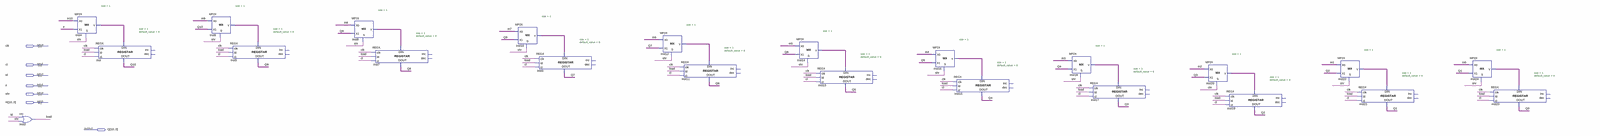
[diagram p0: schematic sheet, whole]
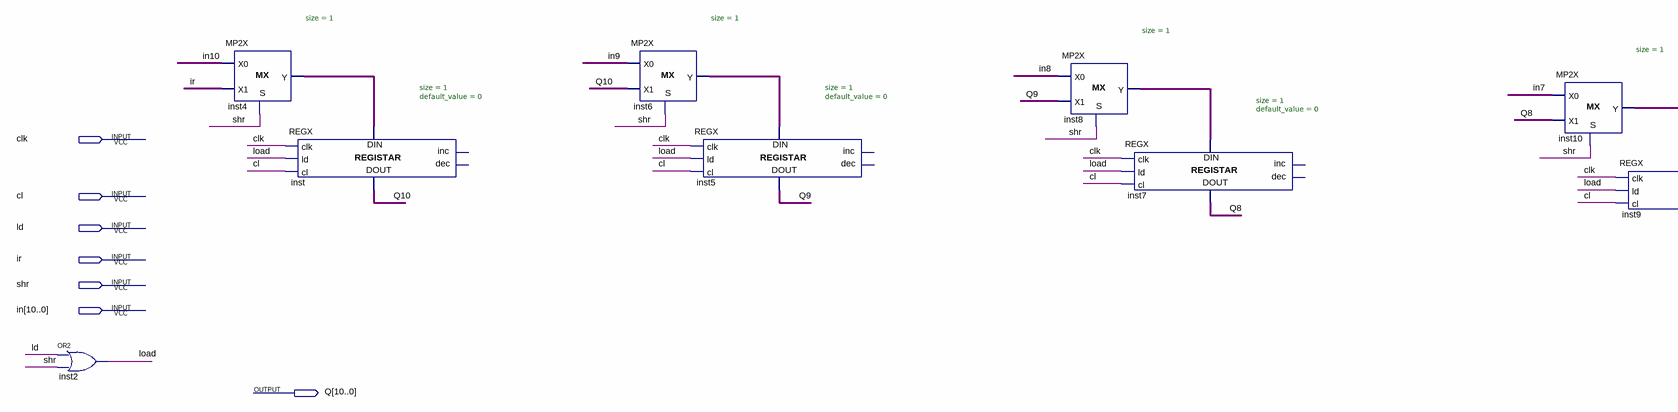
[diagram p1: schematic sheet, left part]
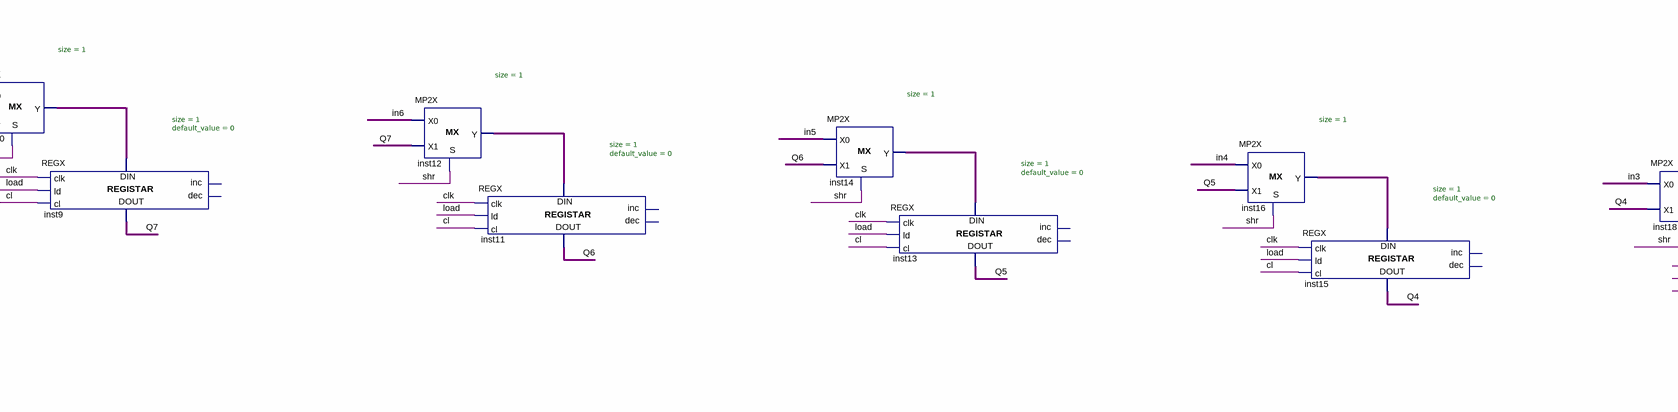
[diagram p2: schematic sheet, centre part]
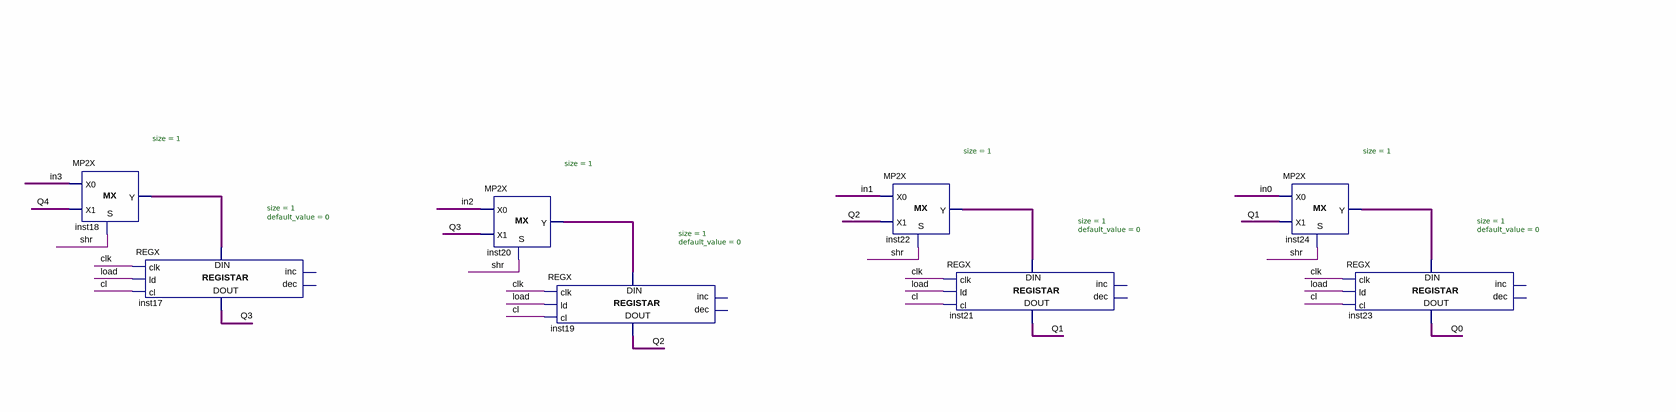
[diagram p3: schematic sheet, right part]
// Quartus schematic REG11.bdf as structural Verilog: 23 symbols, 7 pins
module REG11 (
  input  clk,
  input  cl,
  input  ld,
  input  ir,
  input  shr,
  input  [10:0] in,
  output [10:0] Q
);

  wire inst4_y, inst6_y, inst8_y, inst10_y, inst12_y, inst14_y, inst16_y, inst18_y, inst20_y, inst22_y,
       inst24_y, load;

  or inst2 (load, ld, shr);
  MP2X #(.size(1)) inst4 (.S(shr), .X0(in[10]), .X1(ir), .Y(inst4_y));
  REGX #(.size(1), .default_value(0)) inst (
    .clk(clk), .ld(load), .cl(cl), .data_in(inst4_y), .data_out(Q[10]));  // open: inc, dec
  MP2X #(.size(1)) inst6 (.S(shr), .X0(in[9]), .X1(Q[10]), .Y(inst6_y));
  REGX #(.size(1), .default_value(0)) inst5 (
    .clk(clk), .ld(load), .cl(cl), .data_in(inst6_y), .data_out(Q[9]));  // open: inc, dec
  MP2X #(.size(1)) inst8 (.S(shr), .X0(in[8]), .X1(Q[9]), .Y(inst8_y));
  REGX #(.size(1), .default_value(0)) inst7 (
    .clk(clk), .ld(load), .cl(cl), .data_in(inst8_y), .data_out(Q[8]));  // open: inc, dec
  MP2X #(.size(1)) inst10 (.S(shr), .X0(in[7]), .X1(Q[8]), .Y(inst10_y));
  REGX #(.size(1), .default_value(0)) inst9 (
    .clk(clk), .ld(load), .cl(cl), .data_in(inst10_y), .data_out(Q[7]));  // open: inc, dec
  MP2X #(.size(1)) inst12 (.S(shr), .X0(in[6]), .X1(Q[7]), .Y(inst12_y));
  REGX #(.size(1), .default_value(0)) inst11 (
    .clk(clk), .ld(load), .cl(cl), .data_in(inst12_y), .data_out(Q[6]));  // open: inc, dec
  MP2X #(.size(1)) inst14 (.S(shr), .X0(in[5]), .X1(Q[6]), .Y(inst14_y));
  REGX #(.size(1), .default_value(0)) inst13 (
    .clk(clk), .ld(load), .cl(cl), .data_in(inst14_y), .data_out(Q[5]));  // open: inc, dec
  MP2X #(.size(1)) inst16 (.S(shr), .X0(in[4]), .X1(Q[5]), .Y(inst16_y));
  REGX #(.size(1), .default_value(0)) inst15 (
    .clk(clk), .ld(load), .cl(cl), .data_in(inst16_y), .data_out(Q[4]));  // open: inc, dec
  MP2X #(.size(1)) inst18 (.S(shr), .X0(in[3]), .X1(Q[4]), .Y(inst18_y));
  REGX #(.size(1), .default_value(0)) inst17 (
    .clk(clk), .ld(load), .cl(cl), .data_in(inst18_y), .data_out(Q[3]));  // open: inc, dec
  MP2X #(.size(1)) inst20 (.S(shr), .X0(in[2]), .X1(Q[3]), .Y(inst20_y));
  REGX #(.size(1), .default_value(0)) inst19 (
    .clk(clk), .ld(load), .cl(cl), .data_in(inst20_y), .data_out(Q[2]));  // open: inc, dec
  MP2X #(.size(1)) inst22 (.S(shr), .X0(in[1]), .X1(Q[2]), .Y(inst22_y));
  REGX #(.size(1), .default_value(0)) inst21 (
    .clk(clk), .ld(load), .cl(cl), .data_in(inst22_y), .data_out(Q[1]));  // open: inc, dec
  MP2X #(.size(1)) inst24 (.S(shr), .X0(in[0]), .X1(Q[1]), .Y(inst24_y));
  REGX #(.size(1), .default_value(0)) inst23 (
    .clk(clk), .ld(load), .cl(cl), .data_in(inst24_y), .data_out(Q[0]));  // open: inc, dec
endmodule
